# EAGLE design ModularEEG16Ch (EAGLE 4.16)
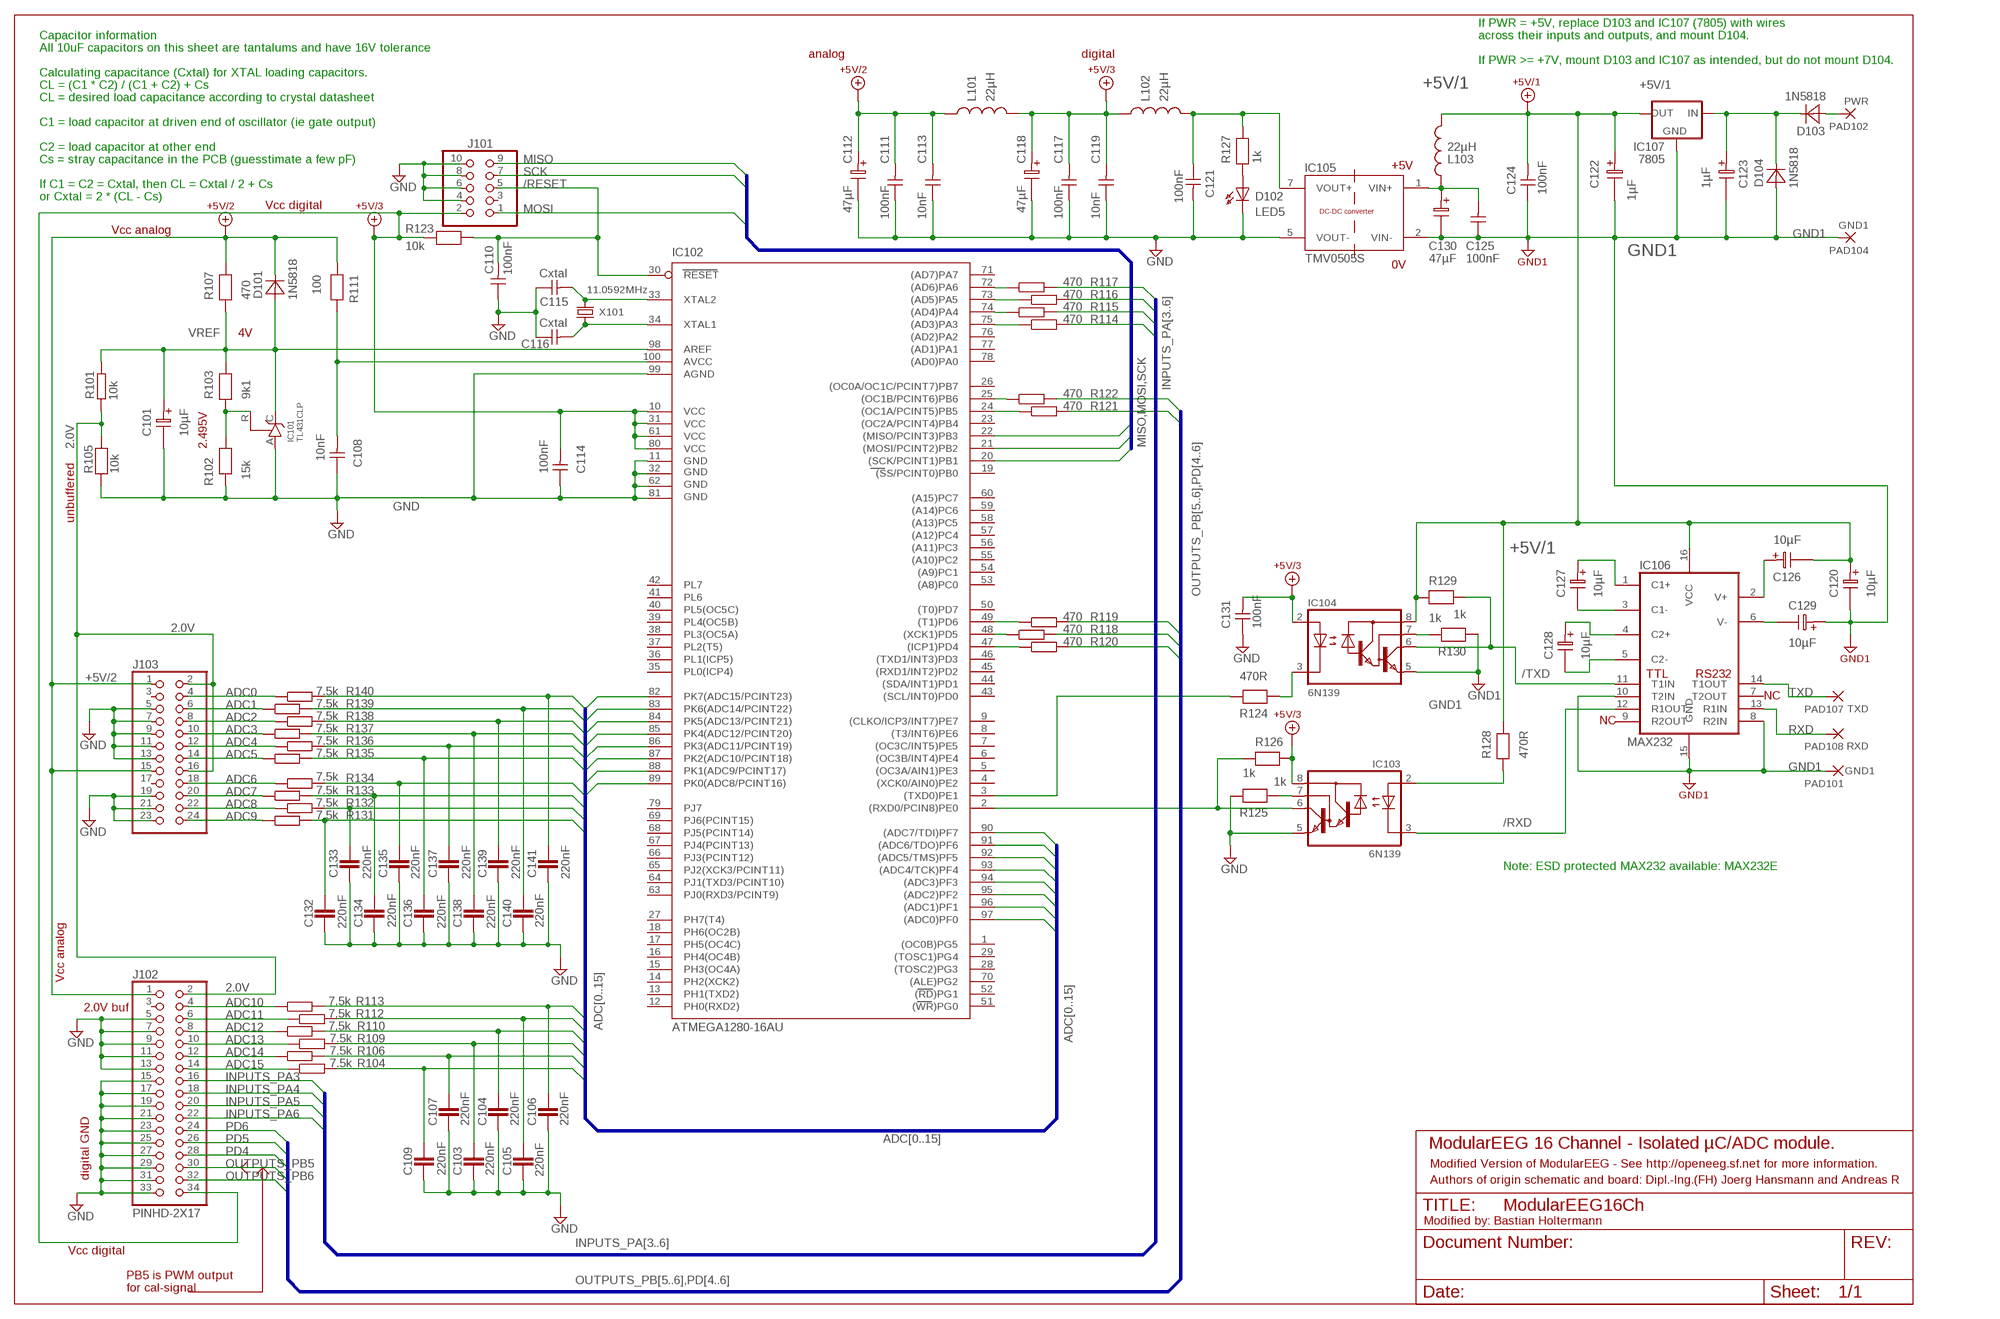
[diagram p0: schematic, sheet 1]

## Parts
C101  10µF  ELC-5  [EL25B]
C103  220nF  C-EUC1206  [C1206]
C104  220nF  C-EUC1206  [C1206]
C105  220nF  C-EUC1206  [C1206]
C106  220nF  C-EUC1206  [C1206]
C107  220nF  C-EUC1206  [C1206]
C108  10nF  CAPNP-5  [C-5]
C109  220nF  C-EUC1206  [C1206]
C110  100nF  CAPNP-5  [C-5]
C111  100nF  CAPNP-5  [C-5]
C112  47µF  ELC-5  [EL25B]
C113  10nF  CAPNP-5  [C-5]
C114  100nF  CAPNP-5  [C-5]
C115  Cxtal  CAPNP-5  [C-5]
C116  Cxtal  CAPNP-5  [C-5]
C117  100nF  CAPNP-5  [C-5]
C118  47µF  ELC-5  [EL25B]
C119  10nF  CAPNP-5  [C-5]
C120  10µF  ELC-5  [EL25B]
C121  100nF  CAPNP-5@2  [C-5@1]
C122  1µF  ELC-2,5  [EL25B]
C123  1µF  ELC-2,5  [EL25B]
C124  100nF  CAPNP-5@2  [C-5@1]
C125  100nF  CAPNP-5  [C-5]
C126  10µF  ELC-5  [EL25B]
C127  10µF  ELC-5  [EL25B]
C128  10µF  ELC-5  [EL25B]
C129  10µF  ELC-5  [EL25B]
C130  47µF  ELC-5  [EL25B]
C131  100nF  CAPNP-5  [C-5]
C132  220nF  C-EUC1206  [C1206]
C133  220nF  C-EUC1206  [C1206]
C134  220nF  C-EUC1206  [C1206]
C135  220nF  C-EUC1206  [C1206]
C136  220nF  C-EUC1206  [C1206]
C137  220nF  C-EUC1206  [C1206]
C138  220nF  C-EUC1206  [C1206]
C139  220nF  C-EUC1206  [C1206]
C140  220nF  C-EUC1206  [C1206]
C141  220nF  C-EUC1206  [C1206]
D101  1N5818  DIODE-10  [D-10]
D102  LED5  [LED5]
D103  1N5818  DIODE-12,5  [D-12,5]
D104  1N5818  DIODE-12,5  [D-12,5]
IC101  TL431CLP  [TO92-CLP]
IC102  ATMEGA1280-16AU  [TQFP100]
IC103  6N139  HCPL0700  [DIL-08]
IC104  6N139  HCPL0700  [DIL-08]
IC105  TMV0505S  TMV0505  [TMADCDC]
IC106  MAX232  [DIL-16]
IC107  7805  78XXS  [78XXL_S]
J101  PINHD-2X5  [2X05]
J102  PINHD-2X17  [2X17]
J103  PINHD-2X12  [2X12]
L101  22µH  L-10  [R-12,5]
L102  22µH  L-10  [R-12,5]
L103  22µH  L-10  [R-12,5]
PAD101  GND1  1,6/0,8  [WIREPAD1]
PAD102  PWR  1,6/0,8  [WIREPAD1]
PAD104  GND1  1,6/0,8  [WIREPAD1]
PAD107  TXD  1,6/0,8  [WIREPAD1]
PAD108  RXD  1,6/0,8  [WIREPAD1]
R101  10k  R-EU_M0805  [M0805]
R102  15k  RESEU-10  [R-10]
R103  9k1  RESEU-10  [R-10]
R104  7.5k  R-EU_M0805  [M0805]
R105  10k  RESEU-10  [R-10]
R106  7.5k  R-EU_M0805  [M0805]
R107  470  RESEU-10  [R-10]
R109  7.5k  R-EU_M0805  [M0805]
R110  7.5k  R-EU_M0805  [M0805]
R111  100  RESEU-10  [R-10]
R112  7.5k  R-EU_M0805  [M0805]
R113  7.5k  R-EU_M0805  [M0805]
R114  470  R-EU_M0805  [M0805]
R115  470  R-EU_M0805  [M0805]
R116  470  R-EU_M0805  [M0805]
R117  470  R-EU_M0805  [M0805]
R118  470  R-EU_M0805  [M0805]
R119  470  R-EU_M0805  [M0805]
R120  470  R-EU_M0805  [M0805]
R121  470  R-EU_M0805  [M0805]
R122  470  R-EU_M0805  [M0805]
R123  10k  RESEU-10@2  [R-10]
R124  470R  RESEU-10  [R-10]
R125  1k  RESEU-10  [R-10]
R126  1k  RESEU-10  [R-10]
R127  1k  RESEU-10@2  [R-10]
R128  470R  RESEU-10  [R-10]
R129  1k  RESEU-10  [R-10]
R130  1k  RESEU-10  [R-10]
R131  7.5k  R-EU_M0805  [M0805]
R132  7.5k  R-EU_M0805  [M0805]
R133  7.5k  R-EU_M0805  [M0805]
R134  7.5k  R-EU_M0805  [M0805]
R135  7.5k  R-EU_M0805  [M0805]
R136  7.5k  R-EU_M0805  [M0805]
R137  7.5k  R-EU_M0805  [M0805]
R138  7.5k  R-EU_M0805  [M0805]
R139  7.5k  R-EU_M0805  [M0805]
R140  7.5k  R-EU_M0805  [M0805]
X101  11.0592MHz  HC49/S  [HC49/S]

## Nets
2.0V: J102.2 J103.2 J103.16 R101.1 R105.2
+5V/1: C120.1 C122.1 C124.2 C126.2 IC104.8(VCC) IC106.16(VCC) IC107.OUT L103.2 R128.2 R129.1
+5V/2: C111.2 C112.1 C113.2 D101.2(K) J102.1 J103.1 J103.15 L101.1 R107.2 R111.1
+5V/3: C114.2 C117.2 C118.1 C119.2 C131.2 IC102.10(VCC) IC102.31(VCC1) IC102.61(VCC2) IC102.80(VCC3) IC103.8(VCC) IC104.2(A) J101.2 J102.34 L101.2 L102.1 R123.1 R126.2
+6TO12V: C123.1 D103.2(K) D104.2(K) IC107.IN
/RESET: C110.2 IC102.30(RESET) J101.5 R123.2
/RXD: IC103.3(K) IC106.12(R1OUT)
/TXD: IC104.6(VO) IC106.11(T1IN) R129.2
ADC0: C141.1 IC102.97((ADC0)PF0) R140.2
ADC1: C140.1 IC102.96((ADC1)PF1) R139.2
ADC2: C139.1 IC102.95((ADC2)PF2) R138.2
ADC3: C138.1 IC102.94((ADC3)PF3) R137.2
ADC4: C137.1 IC102.93((ADC4/TCK)PF4) R136.2
ADC5: C136.1 IC102.92((ADC5/TMS)PF5) R135.2
ADC6: C135.1 IC102.91((ADC6/TDO)PF6) R134.2
ADC7: C134.1 IC102.90((ADC7/TDI)PF7) R133.2
ADC8: C133.1 IC102.89(PK0(ADC8/PCINT16)) R132.2
ADC9: C132.1 IC102.88(PK1(ADC9/PCINT17)) R131.2
ADC10: C106.1 IC102.87(PK2(ADC10/PCINT18)) R113.2
ADC11: C105.1 IC102.86(PK3(ADC11/PCINT19)) R112.2
ADC12: C104.1 IC102.85(PK4(ADC12/PCINT20)) R110.2
ADC13: C103.1 IC102.84(PK5(ADC13/PCINT21)) R109.2
ADC14: C107.1 IC102.83(PK6(ADC14/PCINT22)) R106.2
ADC15: C109.1 IC102.82(PK7(ADC15/PCINT23)) R104.2
AVCC: C108.2 IC102.100(AVCC) R111.2
GND: C101.2 C103.2 C104.2 C105.2 C106.2 C107.2 C108.1 C109.2 C110.1 C111.1 C112.2 C113.1 C114.1 C115.1 C116.1 C117.1 C118.2 C119.1 C121.2 C131.1 C132.2 C133.2 C134.2 C135.2 C136.2 C137.2 C138.2 C139.2 C140.2 C141.2 D102.K IC101.A IC102.11(GND) IC102.32(GND1) IC102.62(GND2) IC102.81(GND3) IC102.99(AGND) IC103.5(GND) IC105.5(VOUT-) J101.4 J101.6 J101.8 J101.10 J102.5 J102.7 J102.9 J102.11 J102.13 J102.15 J102.17 J102.19 J102.21 J102.23 J102.25 J102.27 J102.29 J102.31 J102.33 J103.5 J103.7 J103.9 J103.11 J103.13 J103.19 J103.21 J103.23 R102.1 R105.1 R125.2
GND1: C120.2 C122.2 C123.2 C124.1 C125.1 C129.1 C130.2 D104.1(A) IC104.5(GND) IC105.2(VIN-) IC106.8(R2IN) IC106.10(T2IN) IC106.15(GND) IC107.GND PAD101.1(P) PAD104.1(P) R130.1
INPUTS_PA3: J102.16 R114.2
INPUTS_PA4: J102.18 R115.2
INPUTS_PA5: J102.20 R116.2
INPUTS_PA6: J102.22 R117.2
MISO: IC102.22((MISO/PCINT3)PB3) J101.9
MOSI: IC102.21((MOSI/PCINT2)PB2) J101.1
N$1: IC102.72((AD6)PA6) R117.1
N$2: IC102.73((AD5)PA5) R116.1
N$4: IC101.R R102.2 R103.1
N$5: IC102.74((AD4)PA4) R115.1
N$6: IC102.48((XCK1)PD5) R118.1
N$7: IC102.49((T1)PD6) R119.1
N$8: IC104.3(K) R124.1
N$9: IC102.47((ICP1)PD4) R120.1
N$10: C116.2 IC102.34(XTAL1) X101.1
N$11: IC102.24((OC1A/PCINT5)PB5) R121.1
N$12: IC102.25((OC1B/PCINT6)PB6) R122.1
N$14: C121.1 IC105.7(VOUT+) L102.2 R127.2
N$15: D102.A R127.1
N$16: IC102.75((AD3)PA3) R114.1
N$17: J102.4 R113.1
N$18: D103.1(A) PAD102.1(P)
N$19: J103.4 R140.1
N$20: J102.6 R112.1
N$21: J103.6 R139.1
N$22: J102.8 R110.1
N$23: J103.8 R138.1
N$24: J102.10 R109.1
N$25: C115.2 IC102.33(XTAL2) X101.2
N$26: J103.10 R137.1
N$27: J102.12 R106.1
N$28: J103.12 R136.1
N$29: J102.14 R104.1
N$30: J103.14 R135.1
N$31: J103.18 R134.1
N$32: J103.20 R133.1
N$33: J103.22 R132.1
N$34: J103.24 R131.1
N$36: C128.1 IC106.4(C2+)
N$37: C128.2 IC106.5(C2-)
N$38: C127.2 IC106.3(C1-)
N$40: C127.1 IC106.1(C1+)
N$42: C129.2 IC106.6(V-)
N$43: C126.1 IC106.2(V+)
N$44: C125.2 C130.1 IC105.1(VIN+) L103.1
N$52: IC104.7(VB) R130.2
N$53: IC103.7(VB) R125.1
N$61: IC103.2(A) R128.1
OUTPUTS_PB5: J102.30 R121.2
OUTPUTS_PB6: J102.32 R122.2
PD0: IC102.2((RXD0/PCIN8)PE0) IC103.6(VO) R126.1
PD1: IC102.3((TXD0)PE1) R124.2
PD4: J102.28 R120.2
PD5: J102.26 R118.2
PD6: J102.24 R119.2
RXD: IC106.13(R1IN) PAD108.1(P)
SCK: IC102.20((SCK/PCINT1)PB1) J101.7
TXD: IC106.14(T1OUT) PAD107.1(P)
VREF: C101.1 D101.1(A) IC101.C IC102.98(AREF) R101.2 R103.2 R107.1
Unconnected: IC102.1((OC0B)PG5) IC102.4((XCK0/AIN0)PE2) IC102.5((OC3A/AIN1)PE3) IC102.6((OC3B/INT4)PE4) IC102.7((OC3C/INT5)PE5) IC102.8((T3/INT6)PE6) IC102.9((CLKO/ICP3/INT7)PE7) IC102.12(PH0(RXD2)) IC102.13(PH1(TXD2)) IC102.14(PH2(XCK2)) IC102.15(PH3(OC4A)) IC102.16(PH4(OC4B)) IC102.17(PH5(OC4C)) IC102.18(PH6(OC2B)) IC102.19((SS/PCINT0)PB0) IC102.23((OC2A/PCINT4)PB4) IC102.26((OC0A/OC1C/PCINT7)PB7) IC102.27(PH7(T4)) IC102.28((TOSC2)PG3) IC102.29((TOSC1)PG4) IC102.35(PL0(ICP4)) IC102.36(PL1(ICP5)) IC102.37(PL2(T5)) IC102.38(PL3(OC5A)) IC102.39(PL4(OC5B)) IC102.40(PL5(OC5C)) IC102.41(PL6) IC102.42(PL7) IC102.43((SCL/INT0)PD0) IC102.44((SDA/INT1)PD1) IC102.45((RXD1/INT2)PD2) IC102.46((TXD1/INT3)PD3) IC102.50((T0)PD7) IC102.51((WR)PG0) IC102.52((RD)PG1) IC102.53((A8)PC0) IC102.54((A9)PC1) IC102.55((A10)PC2) IC102.56((A11)PC3) IC102.57((A12)PC4) IC102.58((A13)PC5) IC102.59((A14)PC6) IC102.60((A15)PC7) IC102.63(PJ0(RXD3/PCINT9)) IC102.64(PJ1(TXD3/PCINT10)) IC102.65(PJ2(XCK3/PCINT11)) IC102.66(PJ3(PCINT12)) IC102.67(PJ4(PCINT13)) IC102.68(PJ5(PCINT14)) IC102.69(PJ6(PCINT15)) IC102.70((ALE)PG2) IC102.71((AD7)PA7) IC102.76((AD2)PA2) IC102.77((AD1)PA1) IC102.78((AD0)PA0) IC102.79(PJ7) IC106.7(T2OUT) IC106.9(R2OUT) J101.3 J102.3 J103.3 J103.17

## Buses
INPUTS_PA[3..6]
OUTPUTS_PB[5..6],PD[4..6]
MISO,MOSI,SCK
ADC[0..15]

## Notes on the sheet
- If PWR = +5V, replace D103 and IC107 (7805) with wires
- Capacitor information | across their inputs and outputs, and mount D104.
- All 10uF capacitors on this sheet are tantalums and have 16V tolerance
- analog | digital
- If PWR >= +7V, mount D103 and IC107 as intended, but do not mount D104.
- Calculating capacitance (Cxtal) for XTAL loading capacitors.
- CL = (C1 * C2) / (C1 + C2) + Cs
- CL = desired load capacitance according to crystal datasheet
- C1 = load capacitor at driven end of oscillator (ie gate output)
- C2 = load capacitor at other end
- Cs = stray capacitance in the PCB (guesstimate a few pF)
- +5V
- If C1 = C2 = Cxtal, then CL = Cxtal / 2 + Cs
- or Cxtal = 2 * (CL - Cs)
- Vcc digital
- Vcc analog
- 0V
- 4V
- 2.495V
- unbuffered
- TTL | RS232
- NC
- NC
- Note: ESD protected MAX232 available: MAX232E
- Vcc analog
- 2.0V buf
- ModularEEG 16 Channel - Isolated µC/ADC module.
- Modified Version of ModularEEG - See http://openeeg.sf.net for more information.
- digital GND
- Authors of origin schematic and board: Dipl.-Ing.(FH) Joerg Hansmann and Andreas R
- Modified by: Bastian Holtermann
- Vcc digital
- PB5 is PWM output
- for cal-signal

## Library data of the parts
C101 C112 C118 C120 C126-C130 = DISCRETE:ELC-5
C103-C107 C109 C132-C141 = rcl:C-EU: CAPACITOR, European symbol
C108 C110 C111 C113-C117 C119 C125 C131 = DISCRETE:CAPNP-5
C121 C124 = DISCRETE:CAPNP-5@2
C122 C123 = DISCRETE@2:ELC-2,5
D101 = DISCRETE:DIODE-10
D102 = LED:LED5
D103 D104 = DISCRETE:DIODE-12,5
IC101 = V-REG:TL431CLP
IC102 = atmel-2005:ATMEGA*: MICROCONTROLLER 64/128/256 Kbytes FLASH 4 Kbytes EEPROM 8 Kbytes SRAM 86 General Purpose I/O pins 12-channels16-bit PWM 4 x Serial USARTs 16-channels 10-bit A/D
IC103 IC104 = OPTOCPL:HCPL0700
IC105 = modEEG:TMV0505
IC106 = MAXIM:MAX232
IC107 = V-REG@2:78XXS
J101 = PINHEAD:PINHD-2X5: PIN HEADER
J102 = PINHEAD@2:PINHD-2X17
J103 = PINHEAD:PINHD-2X12: PIN HEADER
L101-L103 = DISCRETE@2:L-10
PAD101 PAD102 PAD104 PAD107 PAD108 = WIREPAD:1,6/0,8
R101 R104 R106 R109 R110 R112-R122 R131-R140 = rcl:R-EU_: RESISTOR, European symbol
R102 R103 R105 R107 R111 R124-R126 R128-R130 = DISCRETE:RESEU-10
R123 R127 = DISCRETE:RESEU-10@2
X101 = QUARTZ:HC49/S

## Board
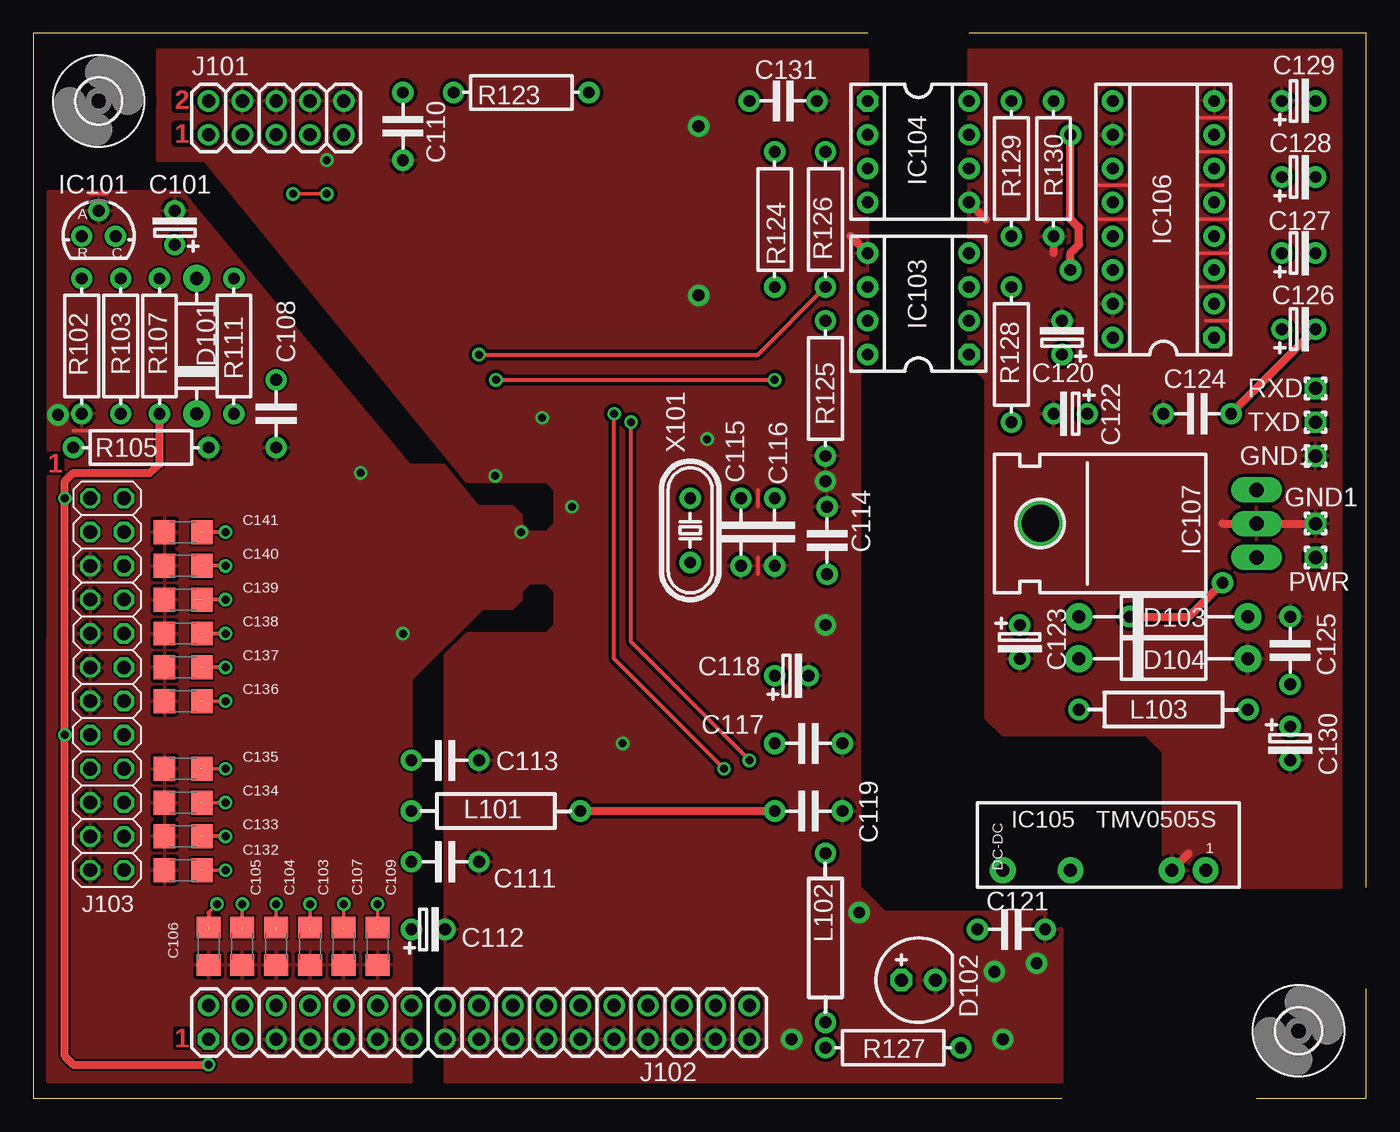
[diagram p1: board, top side]
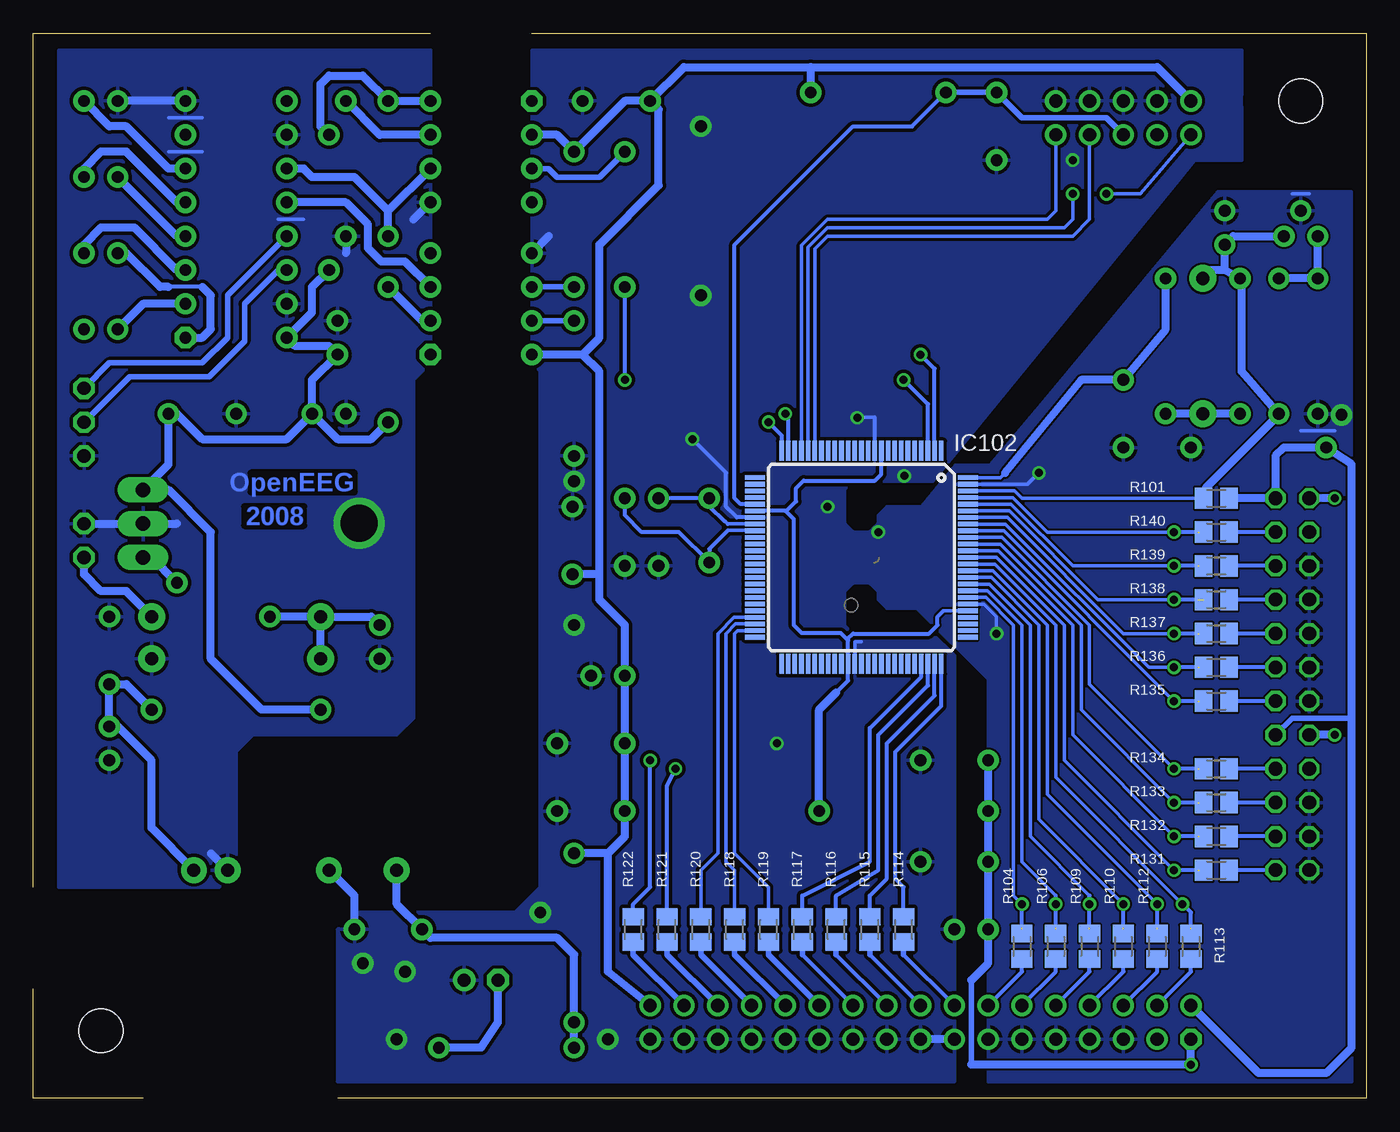
[diagram p2: board, bottom side, seen from below]

Size 100.16 x 80.01 mm. Coordinates in mm from the lower left corner, seen from the top.
Outline: 77.3,0 0,0 0,80.01 62.7,80.01 62.71,80
Outline: 91.91,0 100.16,0 100.16,8.26
Outline: 100.16,15.88 100.16,80.01 70.32,80.01 70.31,80
Copper layers (1*16): Top 0.035mm / dielectric 1.5mm / Bottom 0.035mm
Design rules "default": minimum track width 10mil, minimum drill 22mil, track to track 6mil, track to pad 6mil, pad to pad 6mil, via to via 10mil, smd to smd 6mil, copper to edge 0mil, drill to drill 10mil, minimum pad ring 10mil, minimum via ring 8mil, stop-mask expansion 4mil, vias tented up to drill 0mil, thermal gap 10mil

### Footprints (pad centres in the part's own frame; a part is rotated, then mirrored left to right if it is on the bottom)
EL25B = drill 0.889 pad 1.6 round: 1 -1.27,0; 2 1.27,0
C1206 = smd 1.6 x 1.8: 1 -1.4,0; 2 1.4,0
C-5 = drill 0.889 pad 1.6 round: 1 -2.54,0; 2 2.54,0
D-10 = drill 0.991 pad 2.032 round: 1 -5.08,0; 2 5.08,0
LED5 = drill 0.991 pad 1.676 octagon: A -1.27,0 | drill 0.991 pad 1.676 round: K 1.27,0
D-12,5 = drill 0.991 pad 2.032 round: 1 -6.35,0; 2 6.35,0
TO92-CLP = drill 0.889 pad 1.6 round: A 0,1.905; C 1.27,0; R -1.27,0
TQFP100 = smd 1.5 x 0.35: 1 -8,6; 2 -8,5.5; 3 -8,5; 4 -8,4.5; 5 -8,4; 6 -8,3.5; 7 -8,3; 8 -8,2.5; 9 -8,2; 10 -8,1.5; 11 -8,1; 12 -8,0.5; 13 -8,0; 14 -8,-0.5; 15 -8,-1; 16 -8,-1.5; 17 -8,-2; 18 -8,-2.5; 19 -8,-3; 20 -8,-3.5; 21 -8,-4; 22 -8,-4.5; 23 -8,-5; 24 -8,-5.5; 25 -8,-6; 51 8,-6; 52 8,-5.5; 53 8,-5; 54 8,-4.5; 55 8,-4; 56 8,-3.5; 57 8,-3; 58 8,-2.5; 59 8,-2; 60 8,-1.5; 61 8,-1; 62 8,-0.5; 63 8,0; 64 8,0.5; 65 8,1; 66 8,1.5; 67 8,2; 68 8,2.5; 69 8,3; 70 8,3.5; 71 8,4; 72 8,4.5; 73 8,5; 74 8,5.5; 75 8,6 | smd 0.35 x 1.5: 26 -6,-8; 27 -5.5,-8; 28 -5,-8; 29 -4.5,-8; 30 -4,-8; 31 -3.5,-8; 32 -3,-8; 33 -2.5,-8; 34 -2,-8; 35 -1.5,-8; 36 -1,-8; 37 -0.5,-8; 38 0,-8; 39 0.5,-8; 40 1,-8; 41 1.5,-8; 42 2,-8; 43 2.5,-8; 44 3,-8; 45 3.5,-8; 46 4,-8; 47 4.5,-8; 48 5,-8; 49 5.5,-8; 50 6,-8; 76 6,8; 77 5.5,8; 78 5,8; 79 4.5,8; 80 4,8; 81 3.5,8; 82 3,8; 83 2.5,8; 84 2,8; 85 1.5,8; 86 1,8; 87 0.5,8; 88 0,8; 89 -0.5,8; 90 -1,8; 91 -1.5,8; 92 -2,8; 93 -2.5,8; 94 -3,8; 95 -3.5,8; 96 -4,8; 97 -4.5,8; 98 -5,8; 99 -5.5,8; 100 -6,8
DIL-08 = drill 0.889 pad 1.6 octagon: 1 -3.81,-3.81 | drill 0.889 pad 1.6 round: 2 -1.27,-3.81; 3 1.27,-3.81; 4 3.81,-3.81; 5 3.81,3.81; 6 1.27,3.81; 7 -1.27,3.81; 8 -3.81,3.81
TMADCDC = drill 0.991 pad 1.93 round: 1 1.27,6.35; 2 1.27,3.81; 5 1.27,-3.81; 7 1.27,-8.89
DIL-16 = drill 0.889 pad 1.6 octagon: 1 -8.89,-3.81 | drill 0.889 pad 1.6 round: 2 -6.35,-3.81; 3 -3.81,-3.81; 4 -1.27,-3.81; 5 1.27,-3.81; 6 3.81,-3.81; 7 6.35,-3.81; 8 8.89,-3.81; 9 8.89,3.81; 10 6.35,3.81; 11 3.81,3.81; 12 1.27,3.81; 13 -1.27,3.81; 14 -3.81,3.81; 15 -6.35,3.81; 16 -8.89,3.81
78XXL_S = drill 1.092 pad 1.905 long: GND 0,-0.635; IN -2.54,-0.635; OUT 2.54,-0.635
2X05 = drill 0.991 pad 1.6 round: 1 -5.08,-1.27; 2 -5.08,1.27; 3 -2.54,-1.27; 4 -2.54,1.27; 5 0,-1.27; 6 0,1.27; 7 2.54,-1.27; 8 2.54,1.27; 9 5.08,-1.27; 10 5.08,1.27
2X17 = drill 0.991 pad 1.6 octagon: 1 -20.32,-1.27 | drill 0.991 pad 1.6 round: 2 -20.32,1.27; 3 -17.78,-1.27; 4 -17.78,1.27; 5 -15.24,-1.27; 6 -15.24,1.27; 7 -12.7,-1.27; 8 -12.7,1.27; 9 -10.16,-1.27; 10 -10.16,1.27; 11 -7.62,-1.27; 12 -7.62,1.27; 13 -5.08,-1.27; 14 -5.08,1.27; 15 -2.54,-1.27; 16 -2.54,1.27; 17 0,-1.27; 18 0,1.27; 19 2.54,-1.27; 20 2.54,1.27; 21 5.08,-1.27; 22 5.08,1.27; 23 7.62,-1.27; 24 7.62,1.27; 25 10.16,-1.27; 26 10.16,1.27; 27 12.7,-1.27; 28 12.7,1.27; 29 15.24,-1.27; 30 15.24,1.27; 31 17.78,-1.27; 32 17.78,1.27; 33 20.32,-1.27; 34 20.32,1.27
2X12 = drill 1.016 octagon: 1 -13.97,-1.27; 2 -13.97,1.27; 3 -11.43,-1.27; 4 -11.43,1.27; 5 -8.89,-1.27; 6 -8.89,1.27; 7 -6.35,-1.27; 8 -6.35,1.27; 9 -3.81,-1.27; 10 -3.81,1.27; 11 -1.27,-1.27; 12 -1.27,1.27; 13 1.27,-1.27; 14 1.27,1.27; 15 3.81,-1.27; 16 3.81,1.27; 17 6.35,-1.27; 18 6.35,1.27; 19 8.89,-1.27; 20 8.89,1.27; 21 11.43,-1.27; 22 11.43,1.27; 23 13.97,-1.27; 24 13.97,1.27
R-12,5 = drill 0.889 pad 1.6 round: 1 -6.35,0; 2 6.35,0
WIREPAD1 = drill 0.991 pad 1.6 octagon: 1 0,0
M0805 = smd 1.3 x 1.6: 1 -0.95,0; 2 0.95,0
R-10 = drill 0.889 pad 1.6 round: 1 -5.08,0; 2 5.08,0
3,3 = hole 3.3: 0,0
HC49/S = drill 0.889 pad 1.6 round: 1 -2.413,0; 2 2.413,0

### Placement (x,y rotation side)
C101  10.63,65.41 90 top
C103  20.79,11.43 270 top
C104  18.25,11.43 270 top
C105  15.71,11.43 270 top
C106  13.17,11.43 270 top
C107  23.33,11.43 270 top
C108  18.25,51.44 90 top
C109  25.87,11.43 270 top
C110  27.77,73.03 90 top
C111  30.95,17.78 180 top
C112  29.68,12.7 0 top
C113  30.95,25.4 180 top
C114  59.65,41.91 270 top
C115  53.17,42.55 90 top
C116  55.71,42.55 90 top
C117  58.25,26.67 180 top
C118  56.98,31.75 0 top
C119  58.25,21.59 180 top
C120  77.3,57.15 90 top
C121  100nF  [C-5]  73.5,12.7 0 top
C122  77.94,51.44 180 top
C123  74.13,34.29 270 top
C124  100nF  [C-5]  87.47,51.44 0 top
C125  94.45,33.66 270 top
C126  95.08,57.78 0 top
C127  95.08,63.5 0 top
C128  95.08,69.22 0 top
C129  95.08,74.93 0 top
C130  94.45,26.67 270 top
C131  56.35,74.93 180 top
C132  11.27,17.14 180 top
C133  11.27,19.68 180 top
C134  11.27,22.23 180 top
C135  11.27,24.77 180 top
C136  11.27,29.84 180 top
C137  11.27,32.38 180 top
C138  11.27,34.92 180 top
C139  11.27,37.47 180 top
C140  11.27,40.01 180 top
C141  11.27,42.55 180 top
D101  12.28,56.52 270 top
D102  66.51,8.89 0 top
D103  84.92,36.2 180 top
D104  84.92,33.02 180 top
IC101  4.92,64.77 0 top
IC102  37.94,40.64 270 bottom
IC103  66.51,59.69 90 top
IC104  66.51,71.12 270 top
IC105  81.75,18.41 270 top
IC106  84.92,66.04 90 top
IC107  91.28,43.18 90 top
J101  18.25,73.66 0 top
J102  33.49,5.71 0 top
J103  5.55,31.11 270 top
L101  34.76,21.59 0 top
L102  59.52,12.06 270 top
L103  84.92,29.21 180 top
PAD101  96.36,48.26 0 top
PAD102  96.36,40.64 90 top
PAD104  96.36,43.18 90 top
PAD107  96.36,50.8 90 top
PAD108  96.36,53.34 90 top
R101  11.27,45.09 180 bottom
R102  3.64,56.52 90 top
R103  6.57,56.52 270 top
R104  25.87,11.43 90 bottom
R105  8.09,48.9 180 top
R106  23.33,11.43 90 bottom
R107  9.49,56.52 270 top
R109  20.79,11.43 90 bottom
R110  18.25,11.43 90 bottom
R111  15.08,56.52 90 top
R112  15.71,11.43 90 bottom
R113  13.17,11.43 90 bottom
R114  34.76,12.7 270 bottom
R115  37.3,12.7 270 bottom
R116  39.84,12.7 270 bottom
R117  42.38,12.7 270 bottom
R118  47.46,12.7 270 bottom
R119  44.92,12.7 270 bottom
R120  50,12.7 270 bottom
R121  52.54,12.7 270 bottom
R122  55.08,12.7 270 bottom
R123  36.66,75.56 180 top
R124  55.71,66.04 270 top
R125  59.52,53.34 270 top
R126  59.52,66.04 90 top
R127  64.61,3.81 180 top
R128  73.5,55.88 270 top
R129  73.5,69.85 270 top
R130  76.67,69.85 90 top
R131  11.27,17.14 180 bottom
R132  11.27,19.68 180 bottom
R133  11.27,22.23 180 bottom
R134  11.27,24.77 180 bottom
R135  11.27,29.84 180 bottom
R136  11.27,32.38 180 bottom
R137  11.27,34.92 180 bottom
R138  11.27,37.47 180 bottom
R139  11.27,40.01 180 bottom
R140  11.27,42.55 180 bottom
U$16  [3,3]  95.08,5.08 0 top
U$17  [3,3]  4.92,74.93 0 top
X101  49.37,42.67 90 top

### Tracks (layer width: path | path; a pad name or v marks a point on that pad's centre or on a via)
2.0V
  Bottom 0.406: 1.1,28.57 5.55,28.57 J103.16
  Bottom 0.61: J102.2 8.09,1.91 3.01,1.91 1.1,3.81 1.1,28.57 1.1,47.62 R105.2 6.18,48.9 6.82,48.26 J103.2 R101.1
+5V/1  (via drill 0.89 pad 1.6)
  Top 0.61: v77.94,72.39 77.94,66.04 78.58,65.41 78.58,64.14 77.94,63.5 v77.94,62.23 | C124.2 C126.2
  Bottom 0.61: IC104.8 R129.1 75.4,76.83 77.94,76.83 78.58,76.2 78.58,73.03 v77.94,72.39 | v77.94,62.23 79.21,60.96 79.21,59.05 IC106.16 80.48,56.52 77.94,56.52 C120.1 79.21,53.98 C122.1 | C122.1 81.11,49.53 87.47,49.53 89.37,51.44 C124.2 90,47.62 IC107.OUT 90,45.72 86.83,42.55 86.83,33.02 83.02,29.21 L103.2 | R128.2 74.77,49.53 77.3,49.53 C122.1
+5V/2  (via drill 0.6)
  Top 0.61: R107.2 9.51,47.68 8.73,46.99 3.01,46.99 2.38,46.35 v2.38,45.09 v2.38,27.3 2.38,3.17 3.01,2.54 v13.17,2.54
  Bottom 0.406: 29.68,2.54 29.68,8.89
  Bottom 0.61: C113.2 L101.1 C111.2 C112.1 28.41,10.16 29.68,8.89 | R111.1 D101.2 R107.2 | 29.68,2.54 v13.17,2.54 J102.1 | v2.38,27.3 J103.15 | v2.38,45.09 J103.1
+5V/3
  Top 0.61: C119.2 L101.2
  Bottom 0.254: IC102.80 29.95,36.63 31.79,36.63
  Bottom 0.305: 39.84,30.48 38.94,31.39 IC102.61 38.94,34.42 | 38.94,34.42 38.94,34.56 38.57,34.92 32.85,34.92 32.22,35.56 32.22,36.2 31.79,36.63 | IC102.31 43.64,44.14 43.6,44.09 | 43.6,44.09 43.02,43.51 43.02,35.56 42.41,34.95 39.48,34.95 38.95,34.42 38.94,34.42 | IC102.10 36.44,46.89 36.92,46.41 42.28,46.41 42.84,45.85 42.84,44.86 43.6,44.09
  Bottom 0.61: IC104.2 60.8,72.39 R126.2 55.71,74.93 C131.2 | C131.2 51.27,77.47 41.74,77.47 | 41.74,77.47 15.71,77.47 J101.2 | C131.2 53.17,74.3 53.17,68.58 57.62,64.14 57.62,57.15 58.89,55.88 | 58.89,55.88 IC103.8 | 57.62,39.37 57.62,54.61 58.89,55.88 | 57.62,39.37 C114.2 | 41.74,77.47 R123.1 | L101.2 41.11,29.21 39.84,30.48 | 56.98,18.41 55.71,19.68 C119.2 C117.2 C118.1 55.71,35.56 57.62,37.47 57.62,39.37 | 56.98,18.41 L102.1 | 56.98,18.41 56.98,9.53 J102.34
+6TO12V  (via drill 0.89 pad 1.6)
  Top 0.61: v82.39,36.2 86.83,36.2 v89.37,38.73
  Bottom 0.61: C123.1 74.77,36.2 D103.2 | D104.2 D103.2 | D103.2 v82.39,36.2 | v89.37,38.73 91.28,40.64 IC107.IN
/RESET
  Bottom 0.305: IC102.30 47.02,44.64 47.46,45.09 47.46,64.14 38.57,73.03 34.12,73.03 R123.2
  Bottom 0.406: R123.2 C110.2 25.87,73.66 19.52,73.66 J101.5
/RXD
  Bottom 0.61: IC103.3 72.22,62.87 74,62.87 75.02,63.88 75.02,65.66 76.67,67.31 IC106.12
/TXD
  Bottom 0.61: R129.2 73.5,66.67 | 73.5,66.67 IC104.6 | 73.5,66.67 76.03,69.22 79.21,69.22 79.84,69.85 IC106.11
ADC0  (via drill 0.6)  (1 unrouted)
  Top 0.305: v14.44,42.55 R140.2
  Bottom 0.254: IC102.97 26.56,45.14 23.96,42.55 v14.44,42.55
  Bottom 0.305: 12.54,42.55 R140.2 v14.44,42.55
ADC1  (via drill 0.6)  (1 unrouted)
  Top 0.305: v14.44,40.01 R139.2
  Bottom 0.254: IC102.96 26.7,44.64 22.06,40.01 v14.44,40.01
  Bottom 0.305: 12.54,40.01 R139.2 v14.44,40.01
ADC2  (via drill 0.6)  (1 unrouted)
  Top 0.305: v14.44,37.47 R138.2
  Bottom 0.254: IC102.95 26.83,44.14 20.15,37.47 v14.44,37.47
  Bottom 0.305: R138.2 v14.44,37.47
ADC3  (via drill 0.6)  (1 unrouted)
  Top 0.305: v14.44,34.92 R137.2
  Bottom 0.254: IC102.94 26.96,43.64 18.25,34.92 v14.44,34.92
  Bottom 0.305: 12.54,34.92 R137.2 v14.44,34.92
ADC4  (via drill 0.6)  (1 unrouted)
  Top 0.305: v14.44,32.38 R136.2
  Bottom 0.254: IC102.93 27.1,43.14 16.34,32.38 v14.44,32.38
  Bottom 0.305: 12.54,32.38 R136.2 v14.44,32.38
ADC5  (via drill 0.6)  (1 unrouted)
  Top 0.254: v14.44,29.84 R135.2
  Bottom 0.254: IC102.92 27.23,42.64 v14.44,29.84
  Bottom 0.305: 12.54,29.84 R135.2 v14.44,29.84
ADC6  (via drill 0.6)  (1 unrouted)
  Top 0.254: v14.44,24.77 R134.2
  Bottom 0.254: IC102.91 27.37,42.14 20.79,35.56 20.79,31.11 v14.44,24.77
  Bottom 0.305: 12.54,24.77 R134.2 v14.44,24.77
ADC7  (via drill 0.6)  (1 unrouted)
  Top 0.254: v14.44,22.23 R133.2
  Bottom 0.254: IC102.90 27.5,41.64 21.42,35.56 21.42,29.21 v14.44,22.23
  Bottom 0.305: 12.54,22.23 R133.2 v14.44,22.23
ADC8  (via drill 0.6)  (1 unrouted)
  Top 0.305: v14.44,19.68 R132.2
  Bottom 0.254: IC102.89 27.64,41.14 22.06,35.56 22.06,27.3 v14.44,19.68
  Bottom 0.305: 12.54,19.68 R132.2 v14.44,19.68
ADC9  (via drill 0.6)  (1 unrouted)
  Top 0.254: v14.44,17.14 R131.2
  Bottom 0.254: IC102.88 27.77,40.64 22.7,35.56 22.7,25.4 v14.44,17.14
  Bottom 0.305: 12.54,17.14 R131.2 v14.44,17.14
ADC10  (via drill 0.6)  (1 unrouted)
  Top 0.254: v13.81,14.61 13.17,13.97
  Top 0.305: 13.17,13.97 R113.2
  Bottom 0.254: IC102.87 27.91,40.14 23.33,35.56 23.33,24.13 v13.81,14.61
  Bottom 0.305: v13.81,14.61 13.17,13.97 R113.2 13.17,12.7
ADC11  (via drill 0.6)  (1 unrouted)
  Top 0.254: v15.71,14.61 R112.2
  Bottom 0.254: IC102.86 28.04,39.64 23.96,35.56 23.96,22.86 v15.71,14.61
  Bottom 0.305: 15.71,12.7 R112.2 v15.71,14.61
ADC12  (via drill 0.6)  (1 unrouted)
  Top 0.254: v18.25,14.61 R110.2
  Bottom 0.254: IC102.85 28.18,39.14 24.6,35.56 24.6,20.95 v18.25,14.61
  Bottom 0.305: 18.25,12.7 R110.2 v18.25,14.61
ADC13  (via drill 0.6)  (1 unrouted)
  Top 0.254: v20.79,14.61 R109.2
  Bottom 0.254: IC102.84 28.31,38.64 25.23,35.56 25.23,19.68 20.79,15.24
  Bottom 0.305: 20.79,15.24 v20.79,14.61 R109.2 20.79,12.7
ADC14  (via drill 0.6)  (1 unrouted)
  Top 0.254: v23.33,14.61 R106.2
  Bottom 0.254: IC102.83 28.45,38.14 25.87,35.56 25.87,17.78 23.33,15.24
  Bottom 0.305: 23.33,15.24 v23.33,14.61 R106.2 23.33,12.7
ADC15  (via drill 0.6)  (1 unrouted)
  Top 0.254: v25.87,14.61 R104.2
  Bottom 0.254: IC102.82 28.58,37.64 26.5,35.56 26.5,15.24 v25.87,14.61
  Bottom 0.305: 25.87,12.7 R104.2 v25.87,14.61
AVCC
  Bottom 0.254: IC102.100 27.49,46.64 27.14,46.99
  Bottom 0.61: R111.2 15.08,57.78 C108.2 21.42,53.98 27.14,46.99
GND  (via drill 0.6, 0.89 pad 1.6)
  Top 0.254: 54.45,44.45 54.45,45.72 | 54.45,39.37 54.45,40.64 | 4.28,67.94 5.55,67.94 | 3.01,50.16 4.28,50.16
  Top 0.61: IC103.5 61.43,64.77
  Bottom 0.254: 2.38,50.16 4.92,50.16 | 4.28,67.94 5.55,67.94 | 25.45,46.14 IC102.99 | IC102.81 28.72,37.14 27.77,36.2 v27.77,34.92 | IC102.62 38.44,34.29 37.94,34.29
  Bottom 0.305: v38.24,51.13 36.94,51.16 IC102.11 | v24.6,46.99 25.45,46.14 | IC102.32 47.28,43.64 48.09,44.45 48.09,46.99 v50.63,49.53
  Bottom 0.61: J102.15 J102.17 | IC103.5 61.43,64.77 | C121.2 76.03,15.24 IC105.5
  other vias: 50,60.33 72.86,4.45 62.06,13.97 72.22,9.53 59.52,46.35 1.85,51.35 50,73.03 56.98,4.45 59.52,35.56 75.4,10.16 40.48,44.45 34.71,46.76 22.06,70.48 36.66,42.55 44.28,26.67
  pour Bottom (isolate 0.254): 30.95,1.27 77.3,1.27 77.3,12.7 76.03,13.97 63.97,13.97 62.06,15.88 62.06,54.61 62.7,55.24 62.7,78.74 9.36,78.74 9.36,70.48 12.87,70.48 14.14,68.92 32.55,46.35 38.57,46.35 39.2,45.72 39.2,35.56 38.57,34.92 32.6,34.92 30.95,33.27
  pour Top (isolate 0.254): 9.36,78.74 62.7,78.74 62.7,55.24 62.06,54.61 62.06,15.88 63.97,13.97 76.03,13.97 77.3,12.7 77.3,1.27 30.95,1.27 30.95,33.27 32.6,34.92 38.57,34.92 39.2,35.56 39.2,45.72 38.57,46.35 32.55,46.35 12.87,70.48 9.36,70.48
  pour Bottom: 1.13,68.1 1.1,1.27 28.41,1.27 28.41,31.5 33.77,36.83 36.03,36.83 36.66,37.47 36.66,43.81 36.03,44.45 33.41,44.45 30.87,47.57 28.28,47.57 24.22,52.39 11.15,68.11
  pour Top: 1.13,68.1 11.16,68.1 11.16,68.11 28.28,47.57 30.87,47.57 33.41,44.45 36.03,44.45 36.66,43.81 36.66,37.47 36.03,36.83 33.77,36.83 28.41,31.47 28.41,1.27 1.1,1.27
  pour Top (isolate 0.356): 34.12,43.18 36.66,43.18 37.3,42.55 38.57,42.55 39.2,43.18 41.74,43.18 41.74,38.1 39.2,38.1 38.57,38.73 37.3,38.73 36.66,38.1 34.12,38.1
  pour Bottom: 38.57,42.55 37.3,42.55 36.66,43.18 34.12,43.18 34.12,38.1 36.66,38.1 37.3,38.73 38.57,38.73 39.2,38.1 41.74,38.1 41.74,43.18 39.2,43.18
GND1  (via drill 2.8)
  Top 0.254: 79.84,68.58 82.39,68.58 | 88.1,58.42 90,58.42 | 87.47,63.5 90,63.5 | 87.47,66.04 90,66.04 | 87.47,68.58 89.37,68.58 | 87.47,71.12 90,71.12 | 87.47,73.66 90,73.66 | 79.84,66.04 82.39,66.04 | 87.47,60.96 90,60.96
  Top 0.61: IC105.2 86.83,18.41 | 89.37,43.18 PAD104.1 | IC104.5 71.59,66.04 | R130.1 76.67,63.5
  Bottom 0.254: 79.84,66.04 81.75,66.04 | 87.47,73.66 90,73.66 | 87.47,71.12 90,71.12
  Bottom 0.61: IC106.8 C129.1 | IC105.2 86.83,18.41 | PAD104.1 89.37,43.18 | IC104.5 71.59,66.04 | R130.1 76.67,63.5
  other vias: 75.68,43.21
  pour Bottom (isolate 0.254): 70.32,78.74 98.26,78.74 98.26,15.88 86.19,15.88 84.92,17.14 84.92,26.04 83.66,27.3 72.86,27.3 71.59,28.57 71.59,53.98 70.32,55.24
  pour Top (isolate 0.254): 70.32,78.74 98.26,78.74 98.26,15.88 86.19,15.88 84.92,17.14 84.92,26.04 83.66,27.3 72.86,27.3 71.59,28.57 71.59,53.98 70.32,55.24
INPUTS_PA3
  Bottom 0.305: J102.16 34.76,10.79
  Bottom 0.406: 34.76,11.43 R114.2 34.76,10.79
INPUTS_PA4
  Bottom 0.305: J102.18 37.3,10.79
  Bottom 0.406: 37.3,11.43 R115.2 37.3,10.79
INPUTS_PA5
  Bottom 0.305: J102.20 39.84,10.79
  Bottom 0.406: 39.84,11.43 R116.2 39.84,10.79
INPUTS_PA6
  Bottom 0.305: J102.22 42.38,10.79
  Bottom 0.406: 42.38,11.43 R117.2 42.38,10.79
MISO
  Bottom 0.254: IC102.22 42.44,64.08 40.48,66.04 23.96,66.04 23.33,66.67 J101.9
MOSI  (via drill 0.6)
  Top 0.254: v19.52,67.94 v22.06,67.94
  Bottom 0.254: IC102.21 41.94,63.95 40.48,65.41 22.7,65.41 22.06,66.04 v22.06,67.94 | v19.52,67.94 16.98,67.94 J101.1
N$1
  Bottom 0.305: IC102.72 33.44,31.68 37.3,27.81 37.3,17.78 42.38,15.24 R117.1 42.38,13.97
N$2
  Bottom 0.305: IC102.73 32.94,31.04 36.66,27.3 36.66,17.14 39.84,15.24 R116.1
N$4
  Bottom 0.61: R103.1 R102.2 IC101.R
N$5
  Bottom 0.305: IC102.74 32.44,30.27 36.03,26.67 36.03,16.51 37.3,15.24 R115.1 37.3,13.97
N$6
  Bottom 0.254: IC102.48 47.38,35.64 48.09,34.92 48.09,17.78 47.46,17.14 R118.1
  Bottom 0.305: R118.1 47.46,13.97
N$7
  Bottom 0.254: IC102.49 47.24,35.14 47.46,34.92 47.46,18.41 44.92,15.88 R119.1
  Bottom 0.305: R119.1 44.92,13.97
N$8
  Bottom 0.406: R124.1 57.62,69.22 60.8,69.22 61.43,69.85 IC104.3
N$9
  Bottom 0.254: IC102.47 47.52,36.14 48.73,34.92 48.73,18.41 50,17.14 R120.1
  Bottom 0.305: R120.1 50,13.97
N$10
  Bottom 0.305: IC102.34 47.97,42.67 48.09,42.55 49.37,41.27 X101.1 | X101.1 49.37,40.01 | X101.1 51.65,42.55 54.45,42.55 55.71,43.81 C116.2
N$11  (via drill 0.6)
  Top 0.305: v43.65,51.44 43.65,33.02 v51.91,24.77
  Bottom 0.305: IC102.24 43.44,51.22 v43.65,51.44 | 52.54,13.97 R121.1 52.54,23.5 v51.91,24.77
N$12  (via drill 0.6)
  Top 0.305: v44.92,50.8 44.92,34.29 v53.81,25.4
  Bottom 0.305: 55.08,13.97 R122.1 55.08,14.61 53.81,15.88 v53.81,25.4 | IC102.25 43.94,49.81 v44.92,50.8
N$14
  Bottom 0.61: IC105.7 72.86,14.61 C121.1 70.32,12.06 60.8,12.06 59.52,10.79 L102.2 R127.2
N$15
  Bottom 0.61: D102.A 65.24,5.71 66.51,3.81 R127.1
N$16
  Bottom 0.305: IC102.75 31.93,29.5 35.39,26.04 35.39,16.51 34.76,15.88 R114.1 34.76,13.97
N$17
  Bottom 0.305: R113.1 13.17,9.53 J102.4
N$18
  Bottom 0.61: D103.1 93.18,38.1 95.08,38.1 96.36,39.37 PAD102.1
N$19
  Bottom 0.305: 10,42.55 R140.1 J103.4
N$20
  Bottom 0.305: R112.1 15.71,9.53 J102.6
N$21
  Bottom 0.305: 10,40.01 R139.1 J103.6
N$22
  Bottom 0.305: R110.1 18.25,9.53 J102.8
N$23
  Bottom 0.305: 10,37.47 R138.1 J103.8
N$24
  Bottom 0.305: R109.1 20.79,9.53 J102.10
N$25
  Bottom 0.305: IC102.33 47.98,43.16 48.17,43.33 49.37,44.45 X101.2 C115.2
N$26
  Bottom 0.305: 10,34.92 R137.1 J103.10
N$27
  Bottom 0.305: R106.1 23.33,9.53 J102.12
N$28
  Bottom 0.305: 10,32.38 R136.1 J103.12
N$29
  Bottom 0.305: R104.1 25.87,9.53 J102.14
N$30
  Bottom 0.305: 10,29.84 R135.1 J103.14
N$31
  Bottom 0.305: 10,24.77 R134.1 J103.18
N$32
  Bottom 0.305: 10,22.23 R133.1 J103.20
N$33
  Bottom 0.305: 10,19.68 R132.1 J103.22
N$34
  Bottom 0.305: 10,17.14 R131.1 J103.24
N$36
  Bottom 0.61: IC106.4 89.37,64.77 C128.1
N$37
  Bottom 0.61: IC106.5 89.37,67.31 93.18,71.12 95.08,71.12 96.36,69.85 C128.2
N$38
  Bottom 0.61: IC106.3 89.37,62.23 92.55,65.41 95.08,65.41 96.36,64.14 C127.2
N$40
  Bottom 0.305: 87.47,60.96 90,60.96
  Bottom 0.61: IC106.1 87.47,57.15 86.83,57.78 86.83,60.33 87.47,60.96 | 90,60.96 90.64,60.96 93.18,63.5 C127.1
N$42
  Bottom 0.61: C129.2 94.45,73.03 93.18,73.03 90,69.85 IC106.6
N$43
  Bottom 0.61: IC106.2 91.91,59.69 C126.1
N$44
  Bottom 0.61: IC105.1 91.28,20.32 91.28,25.4 93.81,27.94 C130.1 C125.2 93.18,31.11 L103.1
N$52
  Bottom 0.61: IC104.7 74.13,72.39 R130.2
N$53
  Bottom 0.406: R125.1 IC103.7
N$61
  Bottom 0.61: IC103.2 70.95,58.42 R128.1
OUTPUTS_PB5
  Bottom 0.406: 52.54,11.43 R121.2 52.54,10.79 J102.30
OUTPUTS_PB6
  Bottom 0.406: 55.08,11.43 R122.2 55.08,10.79 J102.32
PD0  (via drill 0.6)
  Top 0.305: v33.49,55.88 54.45,55.88 R126.1
  Bottom 0.305: IC102.2 32.44,54.83 v33.49,55.88
  Bottom 0.406: R126.1 IC103.6
PD1  (via drill 0.6)
  Top 0.305: v34.76,53.98 v55.71,53.98
  Bottom 0.305: IC102.3 32.94,52.15 v34.76,53.98 | v55.71,53.98 R124.2
PD4
  Bottom 0.406: 50,11.43 R120.2 50,10.79 J102.28
PD5
  Bottom 0.406: 47.46,11.43 R118.2 47.46,10.79 J102.26
PD6
  Bottom 0.406: 44.92,11.43 R119.2 44.92,10.79 J102.24
RXD
  Bottom 0.406: IC106.13 85.56,60.33 85.56,57.15 87.47,55.24 94.45,55.24 PAD108.1
SCK
  Bottom 0.254: IC102.20 41.44,63.81 40.48,64.77 22.06,64.77 20.79,66.04 J101.7
TXD
  Bottom 0.406: IC106.14 81.75,62.23 84.29,59.69 84.29,56.9 86.96,54.23 92.93,54.23 PAD107.1
VREF
  Bottom 0.254: IC102.98 26.42,45.64 25.87,45.09 R101.2
  Bottom 0.305: R101.2 12.54,45.09
  Bottom 0.61: IC101.C 10,64.77 C101.1 10.63,62.23 | 10.63,62.23 R107.1 9.36,61.47 9.36,54.61 R103.2 6.5,51.44 12.03,45.91 R101.2 12.22,44.9 12.22,44.77 | D101.1 11.65,62.23 10.63,62.23

### Text on the board
Top: 2 | 1 | 1 | 1
Bottom: OpenEEG | 2008